# Altium schematic sheet EPS_CTRL_A.SchDoc: CTRL-A
size A3; SheetNumber: 13; SheetTotal: 51
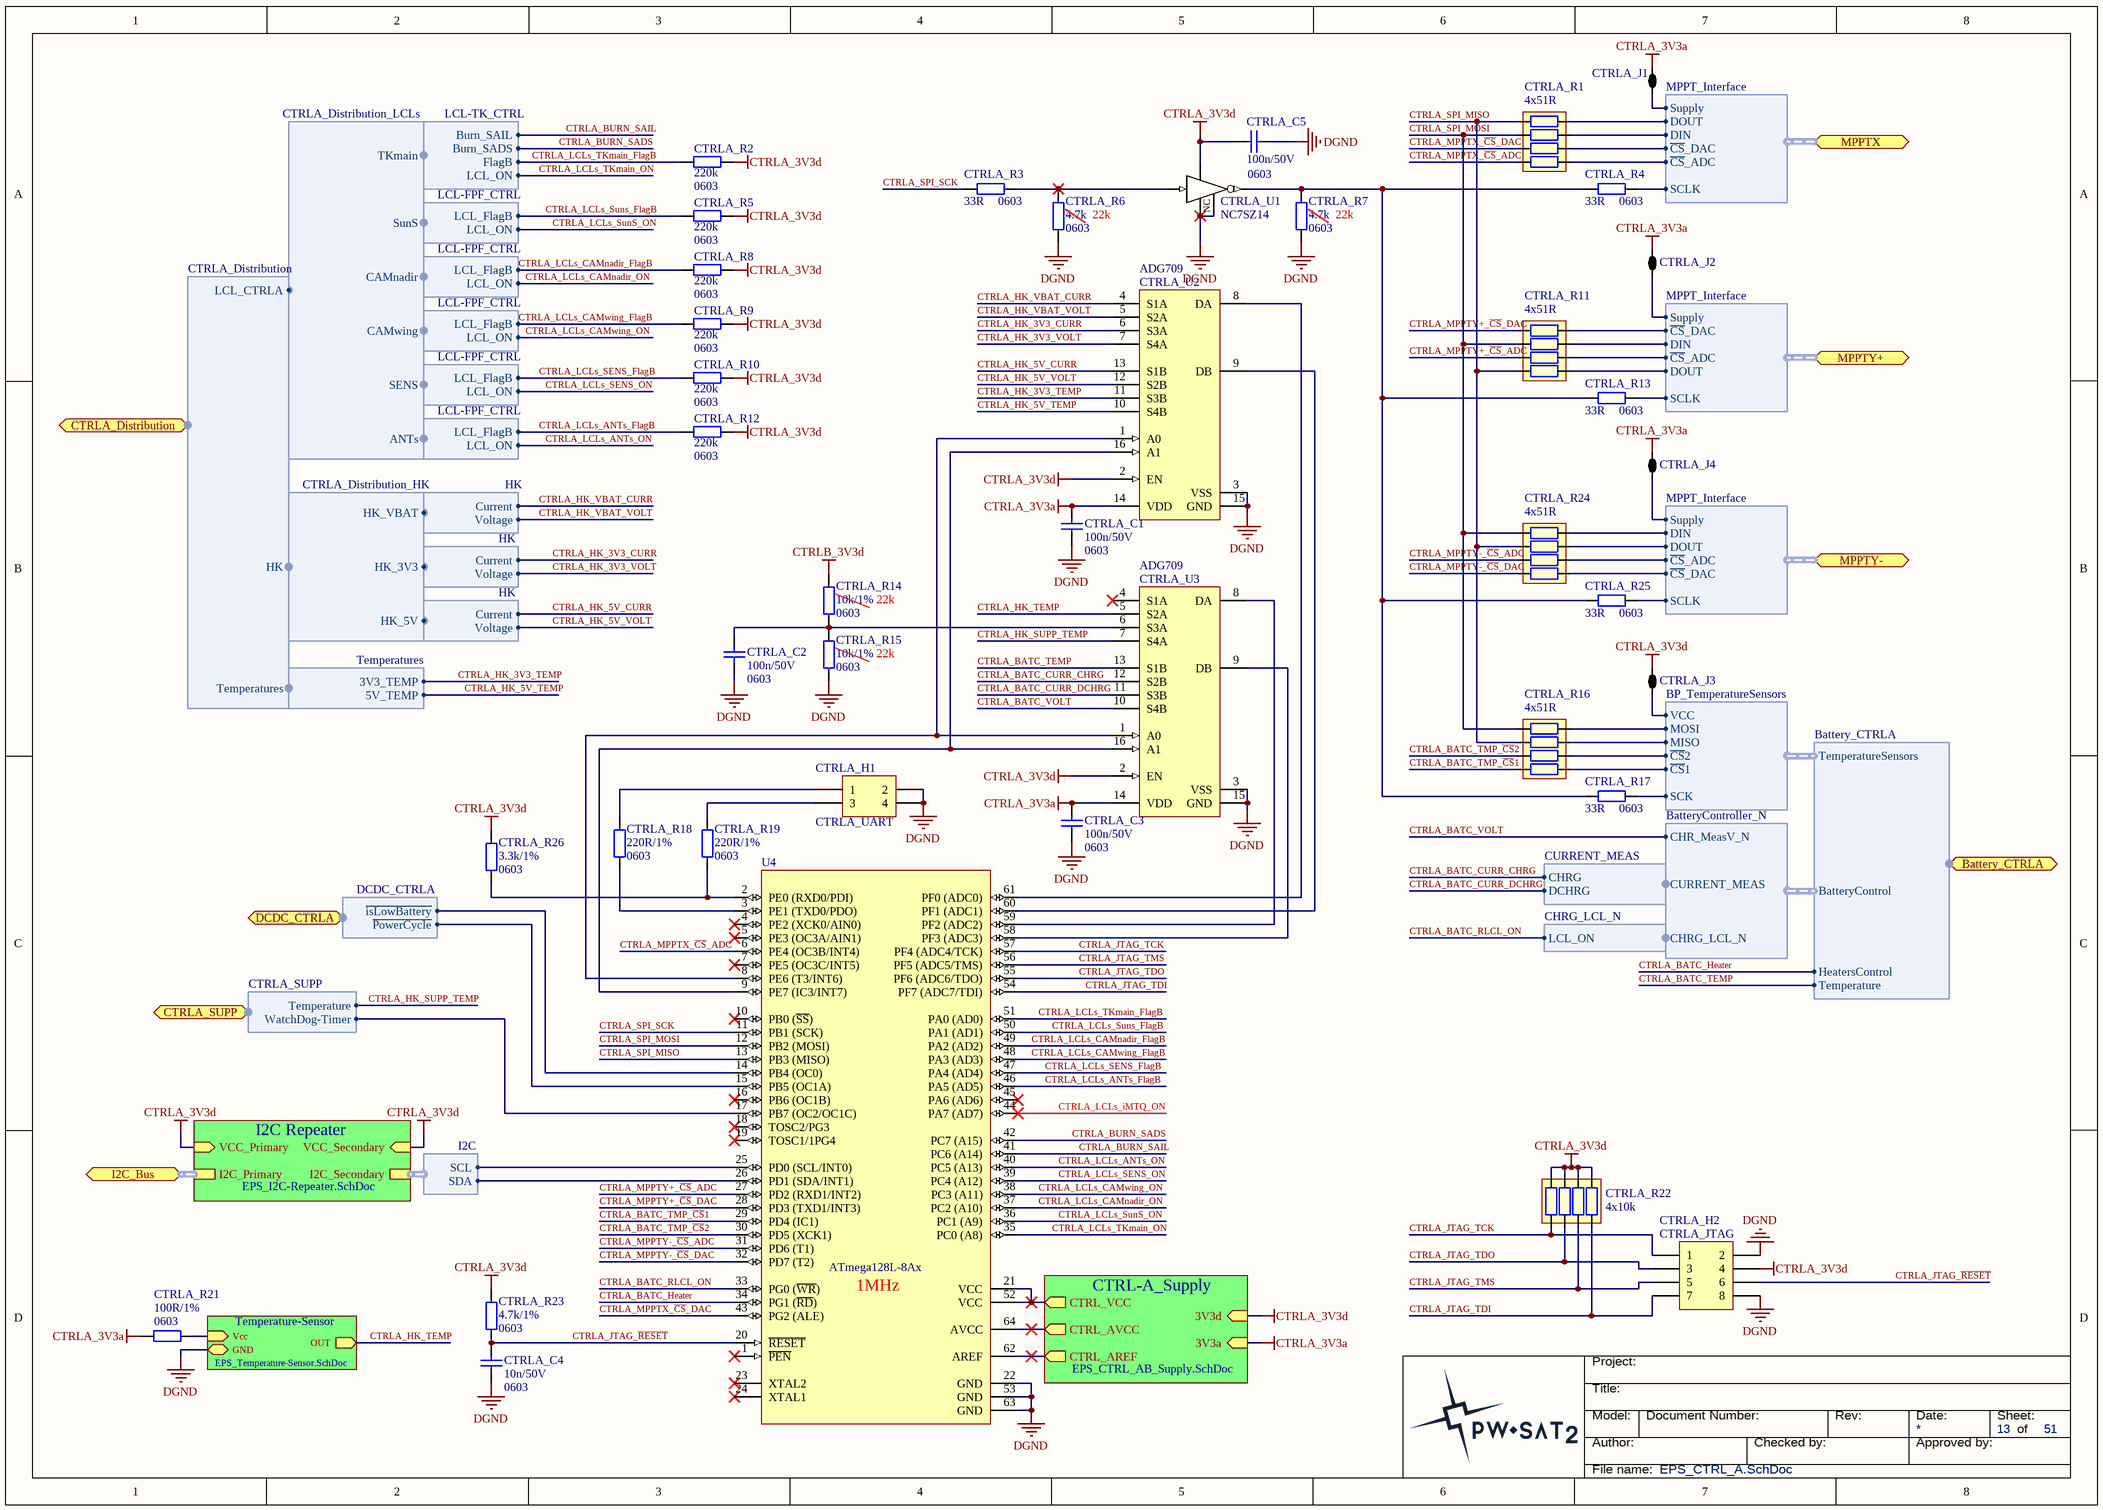
[diagram p0: EPS_CTRL_A.SchDoc]

## Parts
CTRLA_C1  Package: 0603  [SMD_Capacitor_0603]  (hidden comment: 100n/50V)
CTRLA_C2  Package: 0603  [SMD_Capacitor_0603]  (hidden comment: 100n/50V)
CTRLA_C3  Package: 0603  [SMD_Capacitor_0603]  (hidden comment: 100n/50V)
CTRLA_C4  Package: 0603  [SMD_Capacitor_0603]  (hidden comment: 10n/50V)
CTRLA_C5  Package: 0603  [SMD_Capacitor_0603]  (hidden comment: 100n/50V)
CTRLA_H1  CTRLA_UART  [Connfly_DS1031-04-2]
CTRLA_H2  CTRLA_JTAG  [Connfly_DS1031-08-2]
CTRLA_J1  2 way net tie junction  [2way_LP]  (value not drawn)  (net tie, no BOM)
CTRLA_J2  2 way net tie junction  [2way_LP]  (value not drawn)  (net tie, no BOM)
CTRLA_J3  2 way net tie junction  [2way_LP]  (value not drawn)  (net tie, no BOM)
CTRLA_J4  2 way net tie junction  [2way_LP]  (value not drawn)  (net tie, no BOM)
CTRLA_R1  4x51R  [SMD_RESISTOR_ARRAY_YC124]
CTRLA_R2  Package: 0603  [SMD_Resistor_0603]  (hidden comment: 220k)
CTRLA_R3  Package: 0603  [SMD_Resistor_0603]  (hidden comment: 33R)
CTRLA_R4  Package: 0603  [SMD_Resistor_0603]  (hidden comment: 33R)
CTRLA_R5  Package: 0603  [SMD_Resistor_0603]  (hidden comment: 220k)
CTRLA_R6  Package: 0603  [SMD_Resistor_0603]  (hidden comment: 4.7k)
CTRLA_R7  Package: 0603  [SMD_Resistor_0603]  (hidden comment: 4.7k)
CTRLA_R8  Package: 0603  [SMD_Resistor_0603]  (hidden comment: 220k)
CTRLA_R9  Package: 0603  [SMD_Resistor_0603]  (hidden comment: 220k)
CTRLA_R10  Package: 0603  [SMD_Resistor_0603]  (hidden comment: 220k)
CTRLA_R11  4x51R  [SMD_RESISTOR_ARRAY_YC124]
CTRLA_R12  Package: 0603  [SMD_Resistor_0603]  (hidden comment: 220k)
CTRLA_R13  Package: 0603  [SMD_Resistor_0603]  (hidden comment: 33R)
CTRLA_R14  Package: 0603  [SMD_Resistor_0603]  (hidden comment: 10k/1%)
CTRLA_R15  Package: 0603  [SMD_Resistor_0603]  (hidden comment: 10k/1%)
CTRLA_R16  4x51R  [SMD_RESISTOR_ARRAY_YC124]
CTRLA_R17  Package: 0603  [SMD_Resistor_0603]  (hidden comment: 33R)
CTRLA_R18  Package: 0603  [SMD_Resistor_0603]  (hidden comment: 220R/1%)
CTRLA_R19  Package: 0603  [SMD_Resistor_0603]  (hidden comment: 220R/1%)
CTRLA_R21  Package: 0603  [SMD_Resistor_0603]  (hidden comment: 100R/1%)
CTRLA_R22  4x10k  [SMD_RESISTOR_ARRAY_YC124]
CTRLA_R23  Package: 0603  [SMD_Resistor_0603]  (hidden comment: 4.7k/1%)
CTRLA_R24  4x51R  [SMD_RESISTOR_ARRAY_YC124]
CTRLA_R25  Package: 0603  [SMD_Resistor_0603]  (hidden comment: 33R)
CTRLA_R26  Package: 0603  [SMD_Resistor_0603]  (hidden comment: 3.3k/1%)
CTRLA_U1  NC7SZ14  [SOT23-5]
CTRLA_U2  ADG709  [TSSOP16]
CTRLA_U3  ADG709  [TSSOP16]
U4  ATmega128L-8Ax  [64A_N]

## Sub-sheets
CTRL-A_Supply = EPS_CTRL_AB_Supply.SchDoc: CTRL_VCC (out), CTRL_AVCC (out), CTRL_AREF (out), 3V3d (in), 3V3a (in)
I2C Repeater = EPS_I2C-Repeater.SchDoc: I2C_Primary (harness I2C), I2C_Secondary (harness I2C), VCC_Secondary (in), VCC_Primary (in)
Temperature-Sensor = EPS_Temperature-Sensor.SchDoc: OUT (out), Vcc (in), GND

## Ports
Battery_CTRLA (harness Battery_CTRLA), CTRLA_Distribution (harness CTRLA_Distribution), CTRLA_SUPP (harness CTRLA_SUPP), DCDC_CTRLA (harness DCDC_CTRLA), I2C_Bus (harness I2C), MPPTX (harness MPPT_Interface), MPPTY+ (harness MPPT_Interface), MPPTY- (harness MPPT_Interface)

## Harnesses
I2C: SDA, SCL
MPPT_Interface: DIN, DOUT, SCLK, ~{CS}_DAC, ~{CS}_ADC, Supply
Battery_CTRLA: BatteryControl, HeatersControl, TemperatureSensors, Temperature
BatteryController_N: CHRG_LCL_N, CURRENT_MEAS, CHR_MeasV_N
CURRENT_MEAS: CHRG, DCHRG
CHRG_LCL_N: LCL_ON
BP_TemperatureSensors: MISO, VCC, ~{CS}1, ~{CS}2, SCK, MOSI
CTRLA_Distribution_LCLs: TKmain, SunS, CAMnadir, CAMwing, SENS, ANTs
CTRLA_Distribution: LCL_CTRLA, HK, Temperatures
HK: Voltage, Current
CTRLA_Distribution_HK: HK_VBAT, HK_3V3, HK_5V
LCL-FPF_CTRL: LCL_FlagB, LCL_ON
LCL-TK_CTRL: FlagB, LCL_ON, Burn_SAIL, Burn_SADS
Temperatures: 3V3_TEMP, 5V_TEMP
DCDC_CTRLA: ~{PowerCycle}, ~{isLowBattery}
CTRLA_SUPP: Temperature, WatchDog-Timer

## Nets
CTRLA_3V3a: CTRLA_C1.1 CTRLA_C3.1 CTRLA_J1.2 CTRLA_J2.2 CTRLA_J4.2 CTRLA_R21.2 CTRLA_U2.14(VDD) CTRLA_U3.14(VDD) ; sheet CTRL-A_Supply/3V3a
CTRLA_3V3d: CTRLA_C5.1 CTRLA_H2.4 CTRLA_J3.2 CTRLA_R2.1 CTRLA_R5.1 CTRLA_R8.1 CTRLA_R9.1 CTRLA_R10.1 CTRLA_R12.1 CTRLA_R22.1 CTRLA_R22.2 CTRLA_R22.3 CTRLA_R22.4 CTRLA_R23.2 CTRLA_R26.2 CTRLA_U1.5(Vcc) CTRLA_U2.2(EN) CTRLA_U3.2(EN) ; sheet I2C Repeater/VCC_Secondary, sheet I2C Repeater/VCC_Primary, sheet CTRL-A_Supply/3V3d
CTRLB_3V3d: CTRLA_R14.2
DGND: CTRLA_C1.2 CTRLA_C2.2 CTRLA_C3.2 CTRLA_C4.2 CTRLA_C5.2 CTRLA_H1.2 CTRLA_H1.4 CTRLA_H2.2 CTRLA_H2.8 CTRLA_R6.1 CTRLA_R7.1 CTRLA_R15.1 CTRLA_U1.1(NC) CTRLA_U1.3(GND) CTRLA_U2.3(VSS) CTRLA_U2.15(GND) CTRLA_U3.3(VSS) CTRLA_U3.15(GND) U4.22(GND) U4.53(GND) U4.63(GND) ; sheet Temperature-Sensor/GND
CTRLA_BATC_CURR_CHRG: CTRLA_U3.12(S2B) ; harness CURRENT_MEAS.CHRG
CTRLA_BATC_CURR_DCHRG: CTRLA_U3.11(S3B) ; harness CURRENT_MEAS.DCHRG
CTRLA_BATC_Heater: U4.34(PG1_(~{RD})) ; port Battery_CTRLA.HeatersControl
CTRLA_BATC_RLCL_ON: U4.33(PG0_(~{WR})) ; harness CHRG_LCL_N.LCL_ON
CTRLA_BATC_TEMP: CTRLA_U3.13(S1B) ; port Battery_CTRLA.Temperature
CTRLA_BATC_TMP_~{CS}1: CTRLA_R16.8 U4.29(PD4_(IC1))
CTRLA_BATC_TMP_~{CS}2: CTRLA_R16.7 U4.30(PD5_(XCK1))
CTRLA_BATC_VOLT: CTRLA_U3.10(S4B) ; harness BatteryController_N.CHR_MeasV_N
CTRLA_BURN_SADS: U4.42(PC7_(A15)) ; harness LCL-TK_CTRL.Burn_SADS
CTRLA_BURN_SAIL: U4.41(PC6_(A14)) ; harness LCL-TK_CTRL.Burn_SAIL
CTRLA_HK_3V3_CURR: CTRLA_U2.6(S3A) ; harness HK.Current
CTRLA_HK_3V3_TEMP: CTRLA_U2.11(S3B) ; harness Temperatures.3V3_TEMP
CTRLA_HK_3V3_VOLT: CTRLA_U2.7(S4A) ; harness HK.Voltage
CTRLA_HK_5V_CURR: CTRLA_U2.13(S1B) ; harness HK.Current
CTRLA_HK_5V_TEMP: CTRLA_U2.10(S4B) ; harness Temperatures.5V_TEMP
CTRLA_HK_5V_VOLT: CTRLA_U2.12(S2B) ; harness HK.Voltage
CTRLA_HK_SUPP_TEMP: CTRLA_U3.7(S4A) ; port CTRLA_SUPP.Temperature
CTRLA_HK_TEMP: CTRLA_U3.5(S2A) ; sheet Temperature-Sensor/OUT
CTRLA_HK_VBAT_CURR: CTRLA_U2.4(S1A) ; harness HK.Current
CTRLA_HK_VBAT_VOLT: CTRLA_U2.5(S2A) ; harness HK.Voltage
CTRLA_JTAG_~{RESET}: CTRLA_C4.1 CTRLA_H2.6 CTRLA_R23.1 U4.20(~{RESET})
CTRLA_JTAG_TCK: CTRLA_H2.1 CTRLA_R22.5 U4.57(PF4_(ADC4/TCK))
CTRLA_JTAG_TDI: CTRLA_H2.7 CTRLA_R22.8 U4.54(PF7_(ADC7/TDI))
CTRLA_JTAG_TDO: CTRLA_H2.3 CTRLA_R22.6 U4.55(PF6_(ADC6/TDO))
CTRLA_JTAG_TMS: CTRLA_H2.5 CTRLA_R22.7 U4.56(PF5_(ADC5/TMS))
CTRLA_LCLs_ANTs_FlagB: CTRLA_R12.2 U4.46(PA5_(AD5)) ; harness LCL-FPF_CTRL.LCL_FlagB
CTRLA_LCLs_ANTs_ON: U4.40(PC5_(A13)) ; harness LCL-FPF_CTRL.LCL_ON
CTRLA_LCLs_CAMnadir_FlagB: CTRLA_R8.2 U4.49(PA2_(AD2)) ; harness LCL-FPF_CTRL.LCL_FlagB
CTRLA_LCLs_CAMnadir_ON: U4.37(PC2_(A10)) ; harness LCL-FPF_CTRL.LCL_ON
CTRLA_LCLs_CAMwing_FlagB: CTRLA_R9.2 U4.48(PA3_(AD3)) ; harness LCL-FPF_CTRL.LCL_FlagB
CTRLA_LCLs_CAMwing_ON: U4.38(PC3_(A11)) ; harness LCL-FPF_CTRL.LCL_ON
CTRLA_LCLs_SENS_FlagB: CTRLA_R10.2 U4.47(PA4_(AD4)) ; harness LCL-FPF_CTRL.LCL_FlagB
CTRLA_LCLs_SENS_ON: U4.39(PC4_(A12)) ; harness LCL-FPF_CTRL.LCL_ON
CTRLA_LCLs_Suns_FlagB: CTRLA_R5.2 U4.50(PA1_(AD1)) ; harness LCL-FPF_CTRL.LCL_FlagB
CTRLA_LCLs_SunS_ON: U4.36(PC1_(A9)) ; harness LCL-FPF_CTRL.LCL_ON
CTRLA_LCLs_TKmain_FlagB: CTRLA_R2.2 U4.51(PA0_(AD0)) ; harness LCL-TK_CTRL.FlagB
CTRLA_LCLs_TKmain_ON: U4.35(PC0_(A8)) ; harness LCL-TK_CTRL.LCL_ON
CTRLA_MPPTX_~{CS}_ADC: CTRLA_R1.8 U4.6(PE4_(OC3B/INT4))
CTRLA_MPPTX_~{CS}_DAC: CTRLA_R1.7 U4.43(PG2_(ALE))
CTRLA_MPPTY+_~{CS}_ADC: CTRLA_R11.7 U4.27(PD2_(RXD1/INT2))
CTRLA_MPPTY+_~{CS}_DAC: CTRLA_R11.5 U4.28(PD3_(TXD1/INT3))
CTRLA_MPPTY-_~{CS}_ADC: CTRLA_R24.7 U4.31(PD6_(T1))
CTRLA_MPPTY-_~{CS}_DAC: CTRLA_R24.8 U4.32(PD7_(T2))
CTRLA_SPI_MISO: CTRLA_R1.5 CTRLA_R11.8 CTRLA_R16.6 CTRLA_R24.6 U4.13(PB3_(MISO))
CTRLA_SPI_MOSI: CTRLA_R1.6 CTRLA_R11.6 CTRLA_R16.5 CTRLA_R24.5 U4.12(PB2_(MOSI))
CTRLA_SPI_SCK: CTRLA_R3.1 U4.11(PB1_(SCK))
NetCTRLA_C2_1: CTRLA_C2.1 CTRLA_R14.1 CTRLA_R15.2 CTRLA_U3.6(S3A)
NetCTRLA_H1_1: CTRLA_H1.1 CTRLA_R18.2
NetCTRLA_H1_3: CTRLA_H1.3 CTRLA_R19.2
NetCTRLA_J1_1: CTRLA_J1.1 ; port MPPTX.Supply
NetCTRLA_J2_1: CTRLA_J2.1 ; port MPPTY+.Supply
NetCTRLA_J3_1: CTRLA_J3.1 ; harness BP_TemperatureSensors.VCC
NetCTRLA_J4_1: CTRLA_J4.1 ; port MPPTY-.Supply
NetCTRLA_R1_1: CTRLA_R1.1 ; port MPPTX.~{CS}_ADC
NetCTRLA_R1_2: CTRLA_R1.2 ; port MPPTX.~{CS}_DAC
NetCTRLA_R1_3: CTRLA_R1.3 ; port MPPTX.DIN
NetCTRLA_R1_4: CTRLA_R1.4 ; port MPPTX.DOUT
NetCTRLA_R3_2: CTRLA_R3.2 CTRLA_R6.2 CTRLA_U1.2(A)
NetCTRLA_R4_1: CTRLA_R4.1 CTRLA_R7.2 CTRLA_R13.1 CTRLA_R17.1 CTRLA_R25.1 CTRLA_U1.4(Y)
NetCTRLA_R4_2: CTRLA_R4.2 ; port MPPTX.SCLK
NetCTRLA_R11_1: CTRLA_R11.1 ; port MPPTY+.DOUT
NetCTRLA_R11_2: CTRLA_R11.2 ; port MPPTY+.~{CS}_ADC
NetCTRLA_R11_3: CTRLA_R11.3 ; port MPPTY+.DIN
NetCTRLA_R11_4: CTRLA_R11.4 ; port MPPTY+.~{CS}_DAC
NetCTRLA_R13_2: CTRLA_R13.2 ; port MPPTY+.SCLK
NetCTRLA_R16_1: CTRLA_R16.1 ; harness BP_TemperatureSensors.~{CS}1
NetCTRLA_R16_2: CTRLA_R16.2 ; harness BP_TemperatureSensors.~{CS}2
NetCTRLA_R16_3: CTRLA_R16.3 ; harness BP_TemperatureSensors.MISO
NetCTRLA_R16_4: CTRLA_R16.4 ; harness BP_TemperatureSensors.MOSI
NetCTRLA_R17_2: CTRLA_R17.2 ; harness BP_TemperatureSensors.SCK
NetCTRLA_R18_1: CTRLA_R18.1 U4.3(PE1_(TXD0/PDO))
NetCTRLA_R19_1: CTRLA_R19.1 CTRLA_R26.1 U4.2(PE0_(RXD0/PDI))
NetCTRLA_R21_1: CTRLA_R21.1 ; sheet Temperature-Sensor/Vcc
NetCTRLA_R24_1: CTRLA_R24.1 ; port MPPTY-.~{CS}_DAC
NetCTRLA_R24_2: CTRLA_R24.2 ; port MPPTY-.~{CS}_ADC
NetCTRLA_R24_3: CTRLA_R24.3 ; port MPPTY-.DOUT
NetCTRLA_R24_4: CTRLA_R24.4 ; port MPPTY-.DIN
NetCTRLA_R25_2: CTRLA_R25.2 ; port MPPTY-.SCLK
NetCTRLA_U2_1: CTRLA_U2.1(A0) CTRLA_U3.1(A0) U4.8(PE6_(T3/INT6))
NetCTRLA_U2_8: CTRLA_U2.8(DA) U4.61(PF0_(ADC0))
NetCTRLA_U2_9: CTRLA_U2.9(DB) U4.60(PF1_(ADC1))
NetCTRLA_U2_16: CTRLA_U2.16(A1) CTRLA_U3.16(A1) U4.9(PE7_(IC3/INT7))
NetCTRLA_U3_8: CTRLA_U3.8(DA) U4.59(PF2_(ADC2))
NetCTRLA_U3_9: CTRLA_U3.9(DB) U4.58(PF3_(ADC3))
NetU4_14: U4.14(PB4_(OC0)) ; port DCDC_CTRLA.~{isLowBattery}
NetU4_15: U4.15(PB5_(OC1A)) ; port DCDC_CTRLA.~{PowerCycle}
NetU4_17: U4.17(PB7_(OC2/OC1C)) ; port CTRLA_SUPP.WatchDog-Timer
NetU4_21: U4.21(VCC) U4.52(VCC) ; sheet CTRL-A_Supply/CTRL_VCC
NetU4_25: U4.25(PD0_(SCL/INT0)) ; sheet I2C Repeater/I2C_Secondary.SCL
NetU4_26: U4.26(PD1_(SDA/INT1)) ; sheet I2C Repeater/I2C_Secondary.SDA
NetU4_62: U4.62(AREF) ; sheet CTRL-A_Supply/CTRL_AREF
NetU4_64: U4.64(AVCC) ; sheet CTRL-A_Supply/CTRL_AVCC

Not connected (* = marked no-connect by the designer): CTRLA_U3 4(S1A)*; U4 1(~{PEN})* 4(PE2_(XCK0/AIN0))* 5(PE3_(OC3A/AIN1))* 7(PE5_(OC3C/INT5))* 10(PB0_(~{SS}))* 16(PB6_(OC1B))* 18(TOSC2/PG3)* 19(TOSC1/1PG4)* 23(XTAL2)* 24(XTAL1)* 44(PA7_(AD7))* 45(PA6_(AD6))*

## Buses and harness runs
harness port I2C_Bus = sheet I2C Repeater/I2C_Primary

## Notes on the sheet
- (near CTRLA_R6) 22k
- (near CTRLA_R7) 22k
- 22k
- CTRLA_LCLs_iMTQ_ON
- (near U4) 1MHz
- Title:
- Project:
- Author:
- Model:
- Document Number:
- Checked by:
- Rev:
- Date:
- Approved by:
- Sheet:
- of
- File name:

## Library data of the parts
CTRLA_C1-CTRLA_C5 = Cer_C0603T104K5RALTU: Ceramic Cap Kemet COTS 100n/50V X7R 0603; Manufacturer: Kemet; ManufacturerPartNumber: C0603T104K5RALTU
  CTRLA_C1-CTRLA_C3 CTRLA_C5: Value: 100n/50V
  CTRLA_C4: Value: 10n/50V
CTRLA_H1 = Header 2X2: Header, 2-Pin, Dual row; LatestRevisionDate: 17-Jul-2002; LatestRevisionNote: Re-released for DXP Platform.; Publisher: Altium Limited
CTRLA_H2 = Header 4X2: Header, 4-Pin, Dual row; LatestRevisionDate: 17-Jul-2002; LatestRevisionNote: Re-released for DXP Platform.; Publisher: Altium Limited
CTRLA_J1-CTRLA_J4 = 2way: ComponentLink1URL: http://www.edatools.cz/addons; ComponentLink1Description: Source; FootprintNote: LP=12mil, MP=40mil, HP=120mil
CTRLA_R1 CTRLA_R11 CTRLA_R16 CTRLA_R22 CTRLA_R24 = YC124-JR-072K2L: RESISTOR ARRAY, 4 x 0402; URL: http://pl.farnell.com/yageo-phycomp/yc124-jr-072k2l/resistor-array-arv341-4-x-0402/dp/9235388
CTRLA_R2-CTRLA_R10 CTRLA_R12-CTRLA_R15 CTRLA_R17-CTRLA_R19 CTRLA_R23 CTRLA_R25 CTRLA_R26 = CRCW06034K70FKxxxx: 4.7k/1% Vishay CRCW 0603 Resistor. 100mW, 100ppm, 75V.; Manufacturer: Vishay; ManufactuerPartNumber: CRCW06034K70FKxxxx
  CTRLA_R2 CTRLA_R5 CTRLA_R8-CTRLA_R10 CTRLA_R12: Value: 220k
  CTRLA_R3 CTRLA_R4 CTRLA_R13 CTRLA_R17 CTRLA_R25: Value: 33R
  CTRLA_R6 CTRLA_R7: Value: 4.7k
  CTRLA_R14 CTRLA_R15: Value: 10k/1%
  CTRLA_R18 CTRLA_R19: Value: 220R/1%
  CTRLA_R23: Value: 4.7k/1%
  CTRLA_R26: Value: 3.3k/1%
CTRLA_R21 = CRCW06031K00FKxxxx: 1k/1% Vishay CRCW 0603 Resistor. 100mW, 100ppm, 75V.; Manufacturer: Vishay; ManufacturerPartNumber: CRCW06031K00FKxxxx; Value: 100R/1%
CTRLA_U1 = NC7SZ14: TinyLogic UHS TinyLogic UHS Two-Input NAND Gate.; Manufacturer: Fairchild Semiconductor; Value: NC7SZ14
CTRLA_U2 CTRLA_U3 = ADG709: CMOS Analog 4-Channel Multiplexer; Manufacturer: Analog Devices; ManufacturerPartNumber: ADG709
U4 = ATmega128L-8Ax: 128K Bytes of In-System Programmable Flash Memory; Manufacturer: Atmel; ManufacturerPartNumber: ATmega128L-8Ax; Value: ATmega128L-8Ax